# EasyEDA Pro project CM5_Mobo_final.epro, schematic Schematic1
Create Date: 2025-03-16; Page Name: P1; Project Name: CM5 mobo; Schematic Name: Schematic1; Update Date: 2025-06-30; Company: EasyEDA.com; Page Size: A4; Version: V1.0
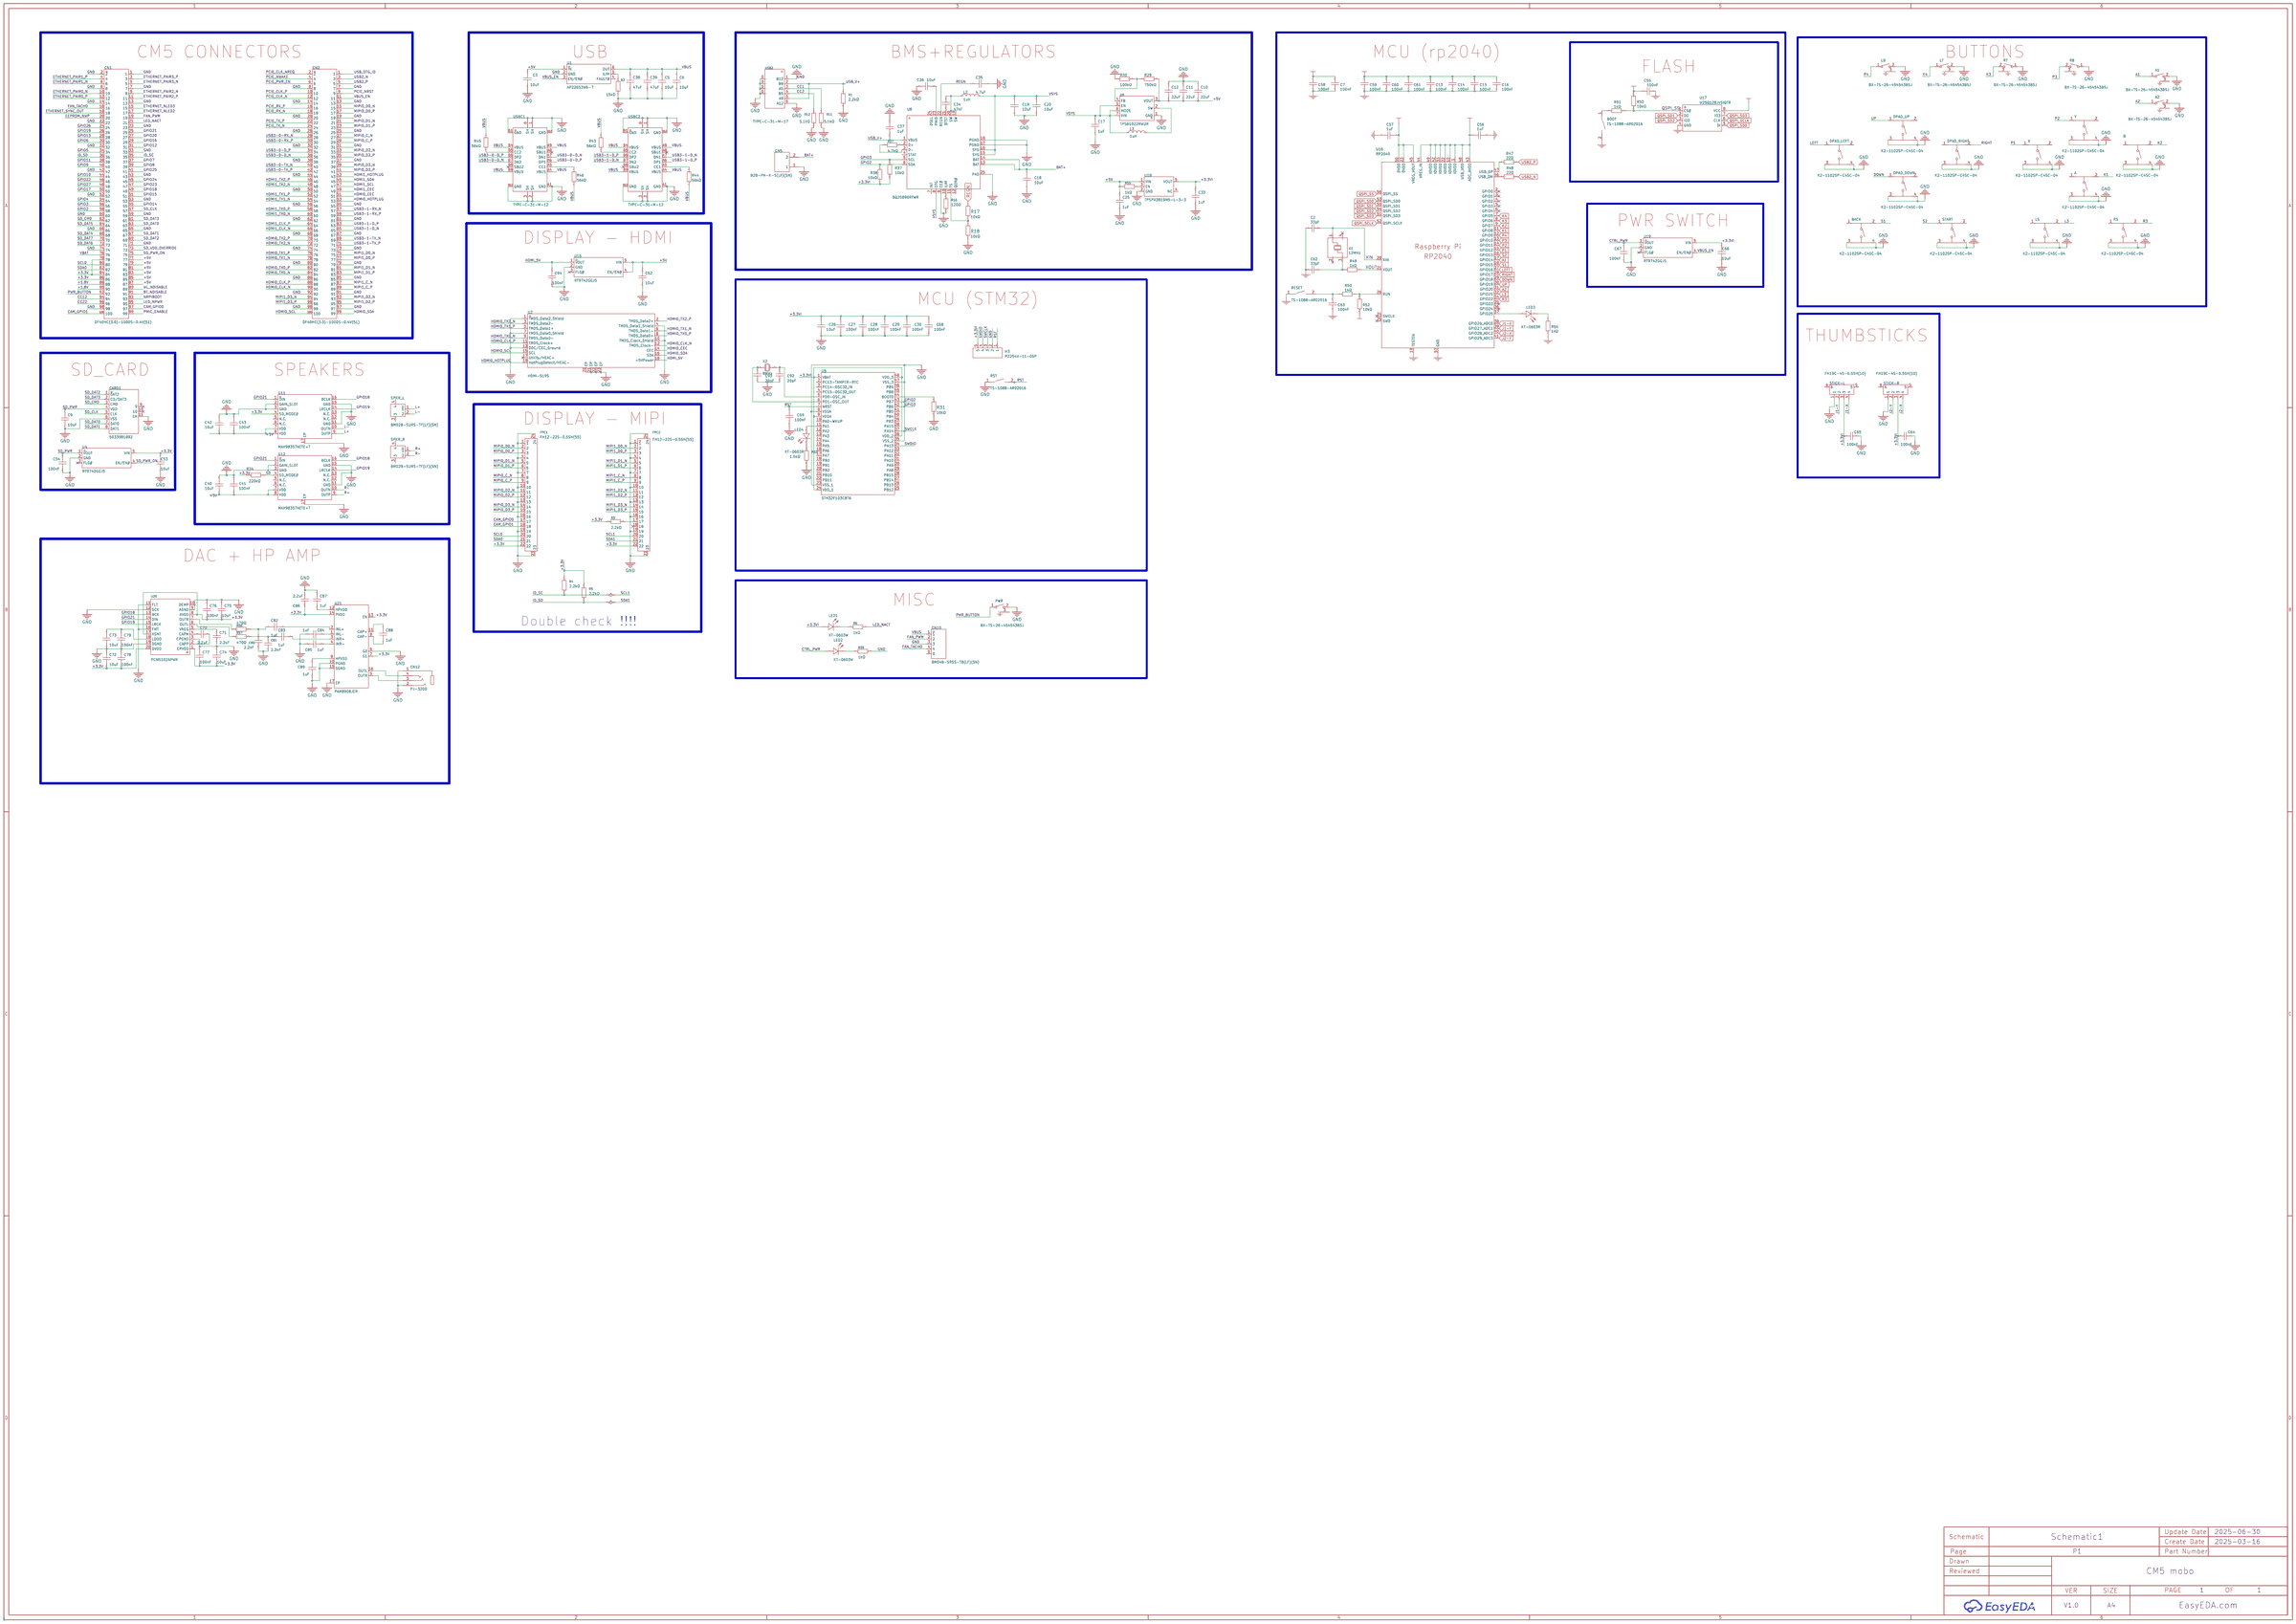
[diagram p0: schematic sheet]

## Parts
A  K2-1102SP-C4SC-04  [KEY-SMD_4P-L6.0-W6.0-P4.50-LS9.5-BL]
A1  BX-TS-26-454543BSJ  [SW-TH_3P-L4.5-W4.3-P3.00-LS1.9]
A2  BX-TS-26-454543BSJ  [SW-TH_3P-L4.5-W4.3-P3.00-LS1.9]
B  K2-1102SP-C4SC-04  [KEY-SMD_4P-L6.0-W6.0-P4.50-LS9.5-BL]
BACK  K2-1102SP-C4SC-04  [KEY-SMD_4P-L6.0-W6.0-P4.50-LS9.5-BL]
BOOT  TS-1088-AR02016  [SW-SMD_L3.9-W3.0-P4.45]
C2  33pF  [C0402]
C3  10uF  [C0805]
C5  10uF  [C0805]
C6  10uF  [C0805]
C7  100nF  [C0402]
C9  10uF  [C0805]
C10  22uF  [C0805]
C11  22uF  [C0805]
C12  22uF  [C0805]
C13  100nF  [C0402]
C14  100nF  [C0402]
C15  100nF  [C0402]
C16  100nF  [C0402]
C17  1uF  [C0603]
C18  10uF  [C0805]
C19  10uF  [C0805]
C20  10uF  [C0805]
C25  1uF  [C0603]
C26  10uF  [C0805]
C27  100nF  [C0402]
C28  100nF  [C0402]
C29  100nF  [C0402]
C30  100nF  [C0402]
C33  1uF  [C0603]
C34  47nF  [C0603]
C35  4.7uF  [C0603]
C36  10uF  [C0805]
C37  1uF  [C0603]
C38  47uF  [C1206]
C39  47uF  [C1206]
C40  10uF  [C0805]
C41  100nF  [C0402]
C42  10uF  [C0805]
C43  100nF  [C0402]
C52  10uF  [C0805]
C53  10uF  [C0805]
C54  100nF  [C0402]
C55  100nF  [C0402]
C56  1uF  [C0402]
C57  1uF  [C0402]
C58  100nF  [C0402]
C59  100nF  [C0402]
C60  100nF  [C0402]
C61  100nF  [C0402]
C62  33pF  [C0402]
C63  100nF  [C0402]
C64  100nF  [C0402]
C65  100nF  [C0402]
C66  10uF  [C0805]
C67  100nF  [C0402]
C68  100nF  [C0402]
C69  100nF  [C0402]
C70  2.2uF  [C0603]
C71  2.2uF  [C0603]
C72  10uF  [C0805]
C73  10uF  [C0805]
C74  10uF  [C0805]
C75  10uF  [C0805]
C76  100nF  [C0603]
C77  100nF  [C0603]
C78  100nF  [C0603]
C79  100nF  [C0603]
C80  2.2nF  [C0805]
C81  2.2nF  [C0805]
C82  1uF  [C0603]
C83  1uF  [C0603]
C84  1uF  [C0603]
C85  1uF  [C0603]
C86  2.2uF  [C0603]
C87  1uF  [C0603]
C88  1uF  [C0603]
C89  1uF  [C0603]
C92  20pF  [C0402]
C93  20pF  [C0402]
C94  100nF  [C0402]
CARD1  5033981892  [TF-SMD_503398-1892]
CN1  DF40HC(3.0)-100DS-0.4V(51)  [CONN-SMD_DF40HC-3.0-100DS-0.4V-51]
CN2  DF40HC(3.0)-100DS-0.4V(51)  [CONN-SMD_DF40HC-3.0-100DS-0.4V-51]
CN5  B2B-PH-K-S(LF)(SN)  [CONN-TH_B2B-PH-K-S]
CN10  BM04B-SRSS-TB(LF)(SN)  [CONN-SMD_BM04B-SRSS-TB]
CN12  PJ-320D  [AUDIO-SMD_PJ-320D]
DPAD_DOWN  K2-1102SP-C4SC-04  [KEY-SMD_4P-L6.0-W6.0-P4.50-LS9.5-BL]
DPAD_LEFT  K2-1102SP-C4SC-04  [KEY-SMD_4P-L6.0-W6.0-P4.50-LS9.5-BL]
DPAD_RIGHT  K2-1102SP-C4SC-04  [KEY-SMD_4P-L6.0-W6.0-P4.50-LS9.5-BL]
DPAD_UP  K2-1102SP-C4SC-04  [KEY-SMD_4P-L6.0-W6.0-P4.50-LS9.5-BL]
FPC1  FH12-22S-0.5SH(55)  [FPC-SMD_22P-P0.50_FH12-22S-0.5SH-55]
FPC2  FH12-22S-0.5SH(55)  [FPC-SMD_22P-P0.50_FH12-22S-0.5SH-55]
H3  PZ254V-11-05P  [HDR-TH_5P-P2.54-V-M]
L2  1uH  [IND-SMD_L4.4-W4.2]
L3  1uH  [IND-SMD_L4.4-W4.2]
LB  BX-TS-26-454543BSJ  [SW-TH_3P-L4.5-W4.3-P3.00-LS1.9]
LED1  KT-0603W  [LED0603-R-RD_WHITE]
LED2  KT-0603W  [LED0603-R-RD_WHITE]
LED3  KT-0603R  [LED0603-RD]
LED4  KT-0603R  [LED0603-RD]
LS  K2-1102SP-C4SC-04  [KEY-SMD_4P-L6.0-W6.0-P4.50-LS9.5-BL]
LT  BX-TS-26-454543BSJ  [SW-TH_3P-L4.5-W4.3-P3.00-LS1.9]
PWR  BX-TS-26-454543BSJ  [SW-TH_3P-L4.5-W4.3-P3.00-LS1.9]
R1  2.2kΩ  [R0402]
R2  15kΩ  [R0402]
R3  2.2kΩ  [R0402]
R4  2.2kΩ  [R0402]
R5  2.2kΩ  [R0402]
R6  1kΩ  [R0402]
R11  5.1kΩ  [R0402]
R12  5.1kΩ  [R0402]
R16  120Ω  [R0603]
R17  10kΩ  [R0603]
R18  10kΩ  [R0603]
R27  4.7kΩ  [R0402]
R29  750kΩ  [R0603]
R30  100kΩ  [R0603]
R31  10kΩ  [R0603]
R32  1.5kΩ  [R0402]
R34  220kΩ  [R0402]
R37  10kΩ  [R0402]
R38  10kΩ  [R0402]
R39  1kΩ  [R0402]
R43  56kΩ  [R0402]
R44  56kΩ  [R0402]
R45  56kΩ  [R0402]
R46  56kΩ  [R0402]
R47  22Ω  [R0402]
R48  22Ω  [R0402]
R49  1kΩ  [R0402]
R50  1kΩ  [R0402]
R51  1kΩ  [R0402]
R52  10kΩ  [R0402]
R53  10kΩ  [R0402]
R54  1kΩ  [R0402]
R55  1kΩ  [R0402]
R56  470Ω  [R0805]
R57  470Ω  [R0805]
RB  BX-TS-26-454543BSJ  [SW-TH_3P-L4.5-W4.3-P3.00-LS1.9]
RESET  TS-1088-AR02016  [SW-SMD_L3.9-W3.0-P4.45]
RS  K2-1102SP-C4SC-04  [KEY-SMD_4P-L6.0-W6.0-P4.50-LS9.5-BL]
RST  TS-1088-AR02016  [SW-SMD_L3.9-W3.0-P4.45]
RT  BX-TS-26-454543BSJ  [SW-TH_3P-L4.5-W4.3-P3.00-LS1.9]
SPKR_L  BM02B-SURS-TF(LF)(SN)  [CONN-SMD_2P-P0.80_BM02B-SURS-TF-LF-SN]
SPKR_R  BM02B-SURS-TF(LF)(SN)  [CONN-SMD_2P-P0.80_BM02B-SURS-TF-LF-SN]
START  K2-1102SP-C4SC-04  [KEY-SMD_4P-L6.0-W6.0-P4.50-LS9.5-BL]
STICK-L  FH19C-4S-0.5SH(10)  [FPC-SMD_FH19C-4S-0.5SH]
STICK-R  FH19C-4S-0.5SH(10)  [FPC-SMD_FH19C-4S-0.5SH]
U1  AP22653W6-7  [SOT-23-6_L2.9-W1.6-P0.95-LS2.8-BR]
U2  HDMI-519S  [HDMI-SMD_19P-P0.40-H-F_HDMI-519S]
U4  RT9742GGJ5  [TSOT-23-5_L2.9-W1.6-P0.95-LS2.8-BR]
U5  STM32F103C8T6  [LQFP-48_L7.0-W7.0-P0.50-LS9.0-BL]
U8  BQ25890RTWR  [WQFN-24_L4.0-W4.0-P0.50-BL-EP]
U9  TPS61022RWUR  [VQFN-7_L2.0-W2.0-P0.55-TL_RWU]
U11  MAX98357AETE+T  [TQFN-16_L3.0-W3.0-P0.50-BL-EP1.5]
U12  MAX98357AETE+T  [TQFN-16_L3.0-W3.0-P0.50-BL-EP1.5]
U15  RT9742GGJ5  [TSOT-23-5_L2.9-W1.6-P0.95-LS2.8-BR]
U16  RP2040  [LQFN-56_L7.0-W7.0-P0.4-EP]
U17  W25Q128JVSIQTR  [SOIC-8_L5.3-W5.3-P1.27-LS8.0-BL]
U18  TPSPX3819M5-L-3-3  [SOT-23-5_L3.0-W1.6-P0.95-LS2.8-BR]
U19  RT9742GGJ5  [TSOT-23-5_L2.9-W1.6-P0.95-LS2.8-BR]
U20  PCM5102APWR  [TSSOP-20_L6.5-W4.4-P0.65-LS6.4-BL]
U21  PAM8908JER  [QFN-16_L3.0-W3.0-P0.50-BL-EP1.7]
USB2  TYPE-C-31-M-17  [USB-C-SMD_10P-P1.00-L6.8-W8.9]
USBC1  TYPE-C-31-M-12  [USB-C_SMD-TYPE-C-31-M-12]
USBC2  TYPE-C-31-M-12  [USB-C_SMD-TYPE-C-31-M-12]
X  K2-1102SP-C4SC-04  [KEY-SMD_4P-L6.0-W6.0-P4.50-LS9.5-BL]
X1  12MHz  [OSC-SMD_4P-L3.2-W2.5-BL]
X2  8MHz  [CRYSTAL-SMD_L5.0-W3.2]
Y  K2-1102SP-C4SC-04  [KEY-SMD_4P-L6.0-W6.0-P4.50-LS9.5-BL]

## Library data of the parts
A B BACK DPAD_DOWN DPAD_LEFT DPAD_RIGHT DPAD_UP LS RS START X Y = K2-1102SP-C4SC-04: Circuit:SPST Actuator Style:Round Button Operating Force:250gf Mounting Style:Brick nogging Switch Length:6mm Switch Width:6mm Switch Height:5mm Contact Current:50mA Voltage Rating (DC):12V Insulation Resistance:100MΩ With Lamp:- Mechanical Life:10万次 Oper; LCSC Part Name: K2-1102SP-C4SC-04 贴片; Supplier Part: C127509; Manufacturer: 韩国韩荣; Supplier Footprint: SMD; JLCPCB Part Class: Extended Part; Datasheet: https://atta.szlcsc.com/upload/public/pdf/source/20180911/C188182_290538218D9CAA74C9E437566D743B7F.pdf; Supplier: LCSC; Circuit: SPST; Actuator Style: Round Button; Operating Force: 250gf; Mounting Style: Brick nogging; Switch Length: 6mm; Switch Width: 6mm; Switch Height: 5mm; Contact Current: 50mA; Voltage Rating (DC): 12V; Insulation Resistance: 100MΩ; Mechanical Life: 10万次; Operating Temperature: -25℃~+85℃
A1 A2 LB LT PWR RB RT = BX-TS-26-454543BSJ: Circuit:SPST Actuator Style:Round Button Operating Force:260gf Mounting Style:Direct Insert Switch Length:4.5mm Switch Width:4.5mm Switch Height:4.3mm Strike Gundam:Without bracket Contact Current:50mA Voltage Rating:12V Actuator/Cap Color:Black Pin Style; LCSC Part Name: 4.5x4.5x4.3边三脚; Supplier Part: C18078076; Manufacturer: Bossie(博锡); Supplier Footprint: 插件-3P,4.5x4.5mm; JLCPCB Part Class: Extended Part; Datasheet: https://atta.szlcsc.com/upload/public/pdf/source/20231017/C9E2CC52EFF4A1EA78B90A8989680BD6.pdf; Supplier: LCSC; Circuit: SPST; Actuator Style: Round Button; Operating Force: 260gf; Mounting Style: Direct Insert; Switch Length: 4.5mm; Switch Width: 4.5mm; Switch Height: 4.3mm; Strike Gundam: Without bracket; Contact Current: 50mA; Voltage Rating: 12V; Actuator/Cap Color: Black; Pin Style: PCPin; Mechanical Life: 100000 Times; Operating Temperature: -30℃~+80℃
BOOT RESET RST = TS-1088-AR02016: Circuit:SPST Actuator Style:Round Button Operating Force:160gf Mounting Style:Brick nogging Switch Length:4mm Switch Width:3mm Switch Height:2mm Strike Gundam:不带 Contact Current:50mA Voltage Rating (DC):12V Insulation Resistance:100MΩ Actuator/Cap Color:B; LCSC Part Name: 4*3*2mm 立贴 轻触开关; Supplier Part: C720477; Manufacturer: XUNPU(讯普); Supplier Footprint: SMD; JLCPCB Part Class: Basic Part; Datasheet: https://atta.szlcsc.com/upload/public/pdf/source/20200810/C720475_60D09DD6C54279ADDB2DC25100F1CC11.pdf; Supplier: LCSC; Circuit: SPST; Actuator Style: Round Button; Operating Force: 160gf; Mounting Style: Brick nogging; Switch Length: 4mm; Switch Width: 3mm; Switch Height: 2mm; Strike Gundam: 不带; Contact Current: 50mA; Voltage Rating (DC): 12V; Insulation Resistance: 100MΩ; Actuator/Cap Color: Black; Pin Style: SMDSplicing; Mechanical Life: 10万次; Operating Temperature: -30℃~+80℃
C2 C62 = 0402CG330J500NT: Supplier: LCSC; Manufacturer: FH(风华); Supplier Part: C1562; JLCPCB Part Class: Basic Part
C3 C5 C6 C9 C18-C20 C26 C36 C40 C42 C52 C53 C66 = CL21A106KAYNNNE_C15850: Capacitance: Tolerance:±10% Tolerance:±10% Voltage Rated: Temperature Coefficient:; LCSC Part Name: 10uF ±10% 25V; Supplier Part: C15850; Manufacturer: SAMSUNG(三星); Manufacturer Part: CL21A106KAYNNNE; Supplier Footprint: 0805; JLCPCB Part Class: Basic Part; Datasheet: https://atta.szlcsc.com/upload/public/pdf/source/20160218/1457707763339.pdf; Supplier: LCSC; Tolerance: ±10%
C7 C13-C16 C55 C58-C61 C63-C65 = CL05B104KO5NNNC: Supplier: LCSC; Manufacturer: SAMSUNG(三星); Supplier Part: C1525; JLCPCB Part Class: Basic Part
C10-C12 = CL21A226MAQNNNE: Capacitance: Tolerance:±20% Tolerance:±20% Voltage Rated: Temperature Coefficient:; LCSC Part Name: 22uF ±20% 25V; Supplier Part: C45783; Manufacturer: SAMSUNG(三星); Supplier Footprint: 0805; JLCPCB Part Class: Basic Part; Datasheet: https://atta.szlcsc.com/upload/public/pdf/source/20160218/1457707763339.pdf; Supplier: LCSC; Tolerance: ±20%
C17 C25 C33 C37 C82-C85 C87-C89 = CL10A105KB8NNNC: Capacitance: Tolerance:±10% Tolerance:±10% Voltage Rated: Temperature Coefficient:; LCSC Part Name: 1uF ±10% 50V; Supplier Part: C15849; Manufacturer: SAMSUNG(三星); Supplier Footprint: 0603; JLCPCB Part Class: Basic Part; Datasheet: https://atta.szlcsc.com/upload/public/pdf/source/20160218/1457707763339.pdf; Supplier: LCSC; Tolerance: ±10%
C27-C30 C41 C43 C54 C67-C69 = CL05B104KB54PNC: Capacitance: Tolerance:±10% Tolerance:±10% Voltage Rated: Temperature Coefficient:; LCSC Part Name: 100nF ±10% 50V; Supplier Part: C307331; Manufacturer: SAMSUNG(三星); Supplier Footprint: 0402; JLCPCB Part Class: Basic Part; Datasheet: https://atta.szlcsc.com/upload/public/pdf/source/20160218/1457707763339.pdf; Supplier: LCSC; Tolerance: ±10%
C34 = CL10B473KB8NNNC: Capacitance: Tolerance:±10% Tolerance:±10% Voltage Rated: Temperature Coefficient:; LCSC Part Name: 47nF ±10% 50V; Supplier Part: C1622; Manufacturer: SAMSUNG(三星); Supplier Footprint: 0603; JLCPCB Part Class: Basic Part; Datasheet: https://atta.szlcsc.com/upload/public/pdf/source/20160218/1457707763339.pdf; Supplier: LCSC; Tolerance: ±10%
C35 = CL10A475KO8NNNC: Capacitance: Tolerance:±10% Tolerance:±10% Voltage Rated: Temperature Coefficient:; LCSC Part Name: 4.7uF ±10% 16V; Supplier Part: C19666; Manufacturer: SAMSUNG(三星); Supplier Footprint: 0603; JLCPCB Part Class: Basic Part; Datasheet: https://atta.szlcsc.com/upload/public/pdf/source/20160218/1457707763339.pdf; Supplier: LCSC; Tolerance: ±10%
C38 C39 = CL31A476MPHNNNE: Capacitance: Tolerance:±20% Tolerance:±20% Voltage Rated: Temperature Coefficient:; LCSC Part Name: 47uF ±20% 10V; Supplier Part: C96123; Manufacturer: SAMSUNG(三星); Supplier Footprint: 1206; JLCPCB Part Class: Basic Part; Datasheet: https://atta.szlcsc.com/upload/public/pdf/source/20160218/1457707763339.pdf; Supplier: LCSC; Tolerance: ±20%
C56 C57 = CL05A105KA5NQNC: Supplier: LCSC; Manufacturer: SAMSUNG(三星); Supplier Part: C52923; JLCPCB Part Class: Basic Part
C70 C71 C86 = CL10A225KO8NNNC: Capacitance: Tolerance:±10% Tolerance:±10% Voltage Rated: Temperature Coefficient:; LCSC Part Name: 2.2uF ±10% 16V; Supplier Part: C23630; Manufacturer: SAMSUNG(三星); Supplier Footprint: 0603; JLCPCB Part Class: Basic Part; Datasheet: https://atta.szlcsc.com/upload/public/pdf/source/20160218/1457707763339.pdf; Supplier: LCSC; Tolerance: ±10%
C72-C75 = GRM21BR61H106KE43L: Capacitance: Tolerance:±10% Tolerance:±10% Voltage Rated: Temperature Coefficient:; LCSC Part Name: 10uF ±10% 50V; Supplier Part: C440198; Manufacturer: muRata(村田); Supplier Footprint: 0805; JLCPCB Part Class: Basic Part; Datasheet: https://atta.szlcsc.com/upload/public/pdf/source/20230811/95AAE0C9AF55EDC31B7A4D8B733F534E.pdf; Supplier: LCSC; Tolerance: ±10%
C76-C79 = CC0603KRX7R9BB104: Capacitance:100nF Tolerance:±10% Tolerance:±10% Voltage Rating:50V Temperature Coefficient:X7R; LCSC Part Name: 100nF ±10% 50V; Supplier Part: C14663; Manufacturer: YAGEO(国巨); Supplier Footprint: 0603; JLCPCB Part Class: Basic Part; Datasheet: https://atta.szlcsc.com/upload/public/pdf/source/20180910/C282072_33301C7F631E79921B82A8DAC6BCC5B3.pdf; Supplier: LCSC; Tolerance: ±10%; Voltage Rating: 50V; Temperature Coefficient: X7R
C80 C81 = CL21C222JBFNNNE: Capacitance: Tolerance:±5% Tolerance:±5% Voltage Rated: Temperature Coefficient:; LCSC Part Name: 2.2nF ±5% 50V; Supplier Part: C28260; Manufacturer: SAMSUNG(三星); Supplier Footprint: 0805; JLCPCB Part Class: Basic Part; Datasheet: https://atta.szlcsc.com/upload/public/pdf/source/20160218/1457707763339.pdf; Supplier: LCSC; Tolerance: ±5%
C92 C93 = 0402CG200J500NT: Capacitance: Tolerance:±5% Tolerance:±5% Voltage Rated: Temperature Coefficient:; LCSC Part Name: 20pF ±5% 50V; Supplier Part: C1554; Manufacturer: FH(风华); Supplier Footprint: 0402; JLCPCB Part Class: Basic Part; Datasheet: https://atta.szlcsc.com/upload/public/pdf/source/20200305/C486355_26A10D38EF8C2A5C37091D0039909270.pdf; Supplier: LCSC; Tolerance: ±5%
C94 = CL05B104KO5NNNC: Capacitance: Tolerance:±10% Tolerance:±10% Voltage Rated: Temperature Coefficient:; LCSC Part Name: 100nF ±10% 16V; Supplier Part: C1525; Manufacturer: SAMSUNG(三星); Supplier Footprint: 0402; JLCPCB Part Class: Basic Part; Datasheet: https://atta.szlcsc.com/upload/public/pdf/source/20160218/1457707763339.pdf; Supplier: LCSC; Tolerance: ±10%
CARD1 = 5033981892: Card Connection Mode:Self-bouncing Card Type:MicroSD card (TF card) Connector Type:Card Slot Additional Card Detection Pins:- Supplementary Features:- Maximum Body Height:1.28mm Operating Temperature Range:-25℃~+85℃ Operating Temperature Range:-25℃~+85℃; LCSC Part Name: 自弹式 MicroSD卡(TF卡) 卡座; Supplier Part: C428492; Manufacturer: MOLEX; Supplier Footprint: SMD; JLCPCB Part Class: Extended Part; Datasheet: https://www.molex.com/content/dam/molex/molex-dot-com/products/automated/en-us/salesdrawingpdf/503/503398/5033981892_sd.pdf?inline; Supplier: LCSC; Card Connection Mode: Self-bouncing; Card Type: MicroSD card (TF card); Connector Type: Card Slot; Maximum Body Height: 1.28mm; Operating Temperature Range: -25℃~+85℃
CN1 CN2 = DF40HC(3.0)-100DS-0.4V(51): Number of Pins:- Pitch:0.4mm Gender:Female Mounting Style:Brick nogging Number of Rows:2 Current Rating (Max):300mA Contact Plating:Gold Operating Temperature Range:-35℃~+85℃ Operating Temperature Range:-35℃~+85℃; LCSC Part Name: 间距:0.4mm 母 立贴; Supplier Part: C424649; Manufacturer: HRS(广濑); Supplier Footprint: SMD,P=0.4mm; JLCPCB Part Class: Extended Part; Datasheet: https://atta.szlcsc.com/upload/public/pdf/source/20190903/C424648_4BEB475664B3701E3114D0DD20EED667.pdf; Supplier: LCSC; Pitch: 0.4mm; Gender: Female; Mounting Style: Brick nogging; Number of Rows: 2; Current Rating (Max): 300mA; Contact Plating: Gold; Operating Temperature Range: -35℃~+85℃
CN5 = B2B-PH-K-S(LF)(SN): Pins Structure:1x2P Pitch:2mm Mounting Type:Direct Insert Reference Series:PH Number of Pins:2P Number of Rows:1 Number of PINs Per Row:2 Row Spacing:- Current Rating:2A Contact Material:Brass Contact Plating:Tin Operating Temperature:-25℃~+85℃ Operating; LCSC Part Name: 1x2P 间距:2mm 直插 系列:PH; Supplier Part: C131337; Manufacturer: JST; Supplier Footprint: 插件,P=2mm; JLCPCB Part Class: Extended Part; Datasheet: https://atta.szlcsc.com/upload/public/pdf/source/20171026/C131342_15089839687311058815.pdf; Supplier: LCSC; Pins Structure: 1x2P; Pitch: 2mm; Mounting Type: Direct Insert; Reference Series: PH; Number of Pins: 2P; Number of Rows: 1; Number of PINs Per Row: 2; Current Rating: 2A; Contact Material: Brass; Contact Plating: Tin; Operating Temperature: -25℃~+85℃; Voltage Rating: 100V; Plastic Material: PA66; Flame Retardant Rating: UL94V-0; Supplementary Features: K-leg punch; Color: White; Z-Height of the Board: 6mm; X-Length of Bottom Edge on Board (Spacing Line): 5.9mm; Y-Width of Bottom Edge on Board: 4.5mm
CN10 = BM04B-SRSS-TB(LF)(SN): Pins Structure:1x4P Pitch:1mm Mounting Style:Standing paste Reference Series:SH Number of Pins:4P Number of Rows:1 Number of PINs Per Row:4 Row Spacing:- Current Rating (Max):1A Contact Material:Copper alloy Contact Plating:Tin Operating Temperature Range; LCSC Part Name: 1x4P 间距:1mm 立贴 系列:SH; Supplier Part: C160390; Manufacturer: JST; Supplier Footprint: SMD,P=1mm; JLCPCB Part Class: Extended Part; Datasheet: https://atta.szlcsc.com/upload/public/pdf/source/20181008/C268118_5C0FE2784716D1E5DD0A36233D1E1F34.pdf; Supplier: LCSC; Pins Structure: 1x4P; Pitch: 1mm; Mounting Style: Standing paste; Reference Series: SH; Number of Pins: 4P; Number of Rows: 1; Number of PINs Per Row: 4; Current Rating (Max): 1A; Contact Material: Copper alloy; Contact Plating: Tin; Operating Temperature Range: -25℃~+85℃; Rated Voltage (Max): 50V; Plastic Material: PA; Flame Retardant Rating: UL94V-0; Supplementary Features: Auxiliary soldering legs; Colour: White; Z-Height of the Board: 4.25mm; X-Length of Bottom Edge on Board (Spacing Line): 6mm; Y-Width of Bottom Edge on Board: 3.6mm
CN12 = PJ-320D_C431535: Connector Type:3.5mm Headphone Jack Current Rating (Max):500mA Voltage Rating (Max):50V Contact Material:Copper Contact Plating:Silver Operating Temperature Range:-30℃~+70℃ Operating Temperature Range:-30℃~+70℃; LCSC Part Name: 3.5mm耳机座; Supplier Part: C431535; Manufacturer: SHOU HAN(首韩); Supplier Footprint: SMD; JLCPCB Part Class: Extended Part; Datasheet: https://atta.szlcsc.com/upload/public/pdf/source/20190925/C431535_8B274506621F6117FB020BF07A197848.pdf; Supplier: LCSC; Connector Type: 3.5mm Headphone Jack; Current Rating (Max): 500mA; Voltage Rating (Max): 50V; Contact Material: Copper; Contact Plating: Silver; Operating Temperature Range: -30℃~+70℃
FPC1 FPC2 = FH12-22S-0.5SH(55)_C597981: Locking Feature:Clamshell Contact Type:Bottom Contact Number of Contacts:22P Pitch:0.5mm Mounting Type:卧贴 FFC, FCB Thickness:0.3mm FFC, FCB Thickness:0.3mm Height Above Board:2mm Contact Material:Phosphor bronze Contact Plating:Gold Operating Temperature; LCSC Part Name: 间距:0.5mm P数:22P 翻盖式 下接; Supplier Part: C597981; Manufacturer: HRS(广濑); Supplier Footprint: SMD,P=0.5mm,卧贴; JLCPCB Part Class: Extended Part; Datasheet: https://atta.szlcsc.com/upload/public/pdf/source/20200615/C597979_B8D9DC319DDA9CB4DF2E85AE104C9A2E.pdf; Supplier: LCSC; Locking Feature: Clamshell; Contact Type: Bottom Contact; Number of Contacts: 22P; Pitch: 0.5mm; Mounting Type: 卧贴; FFC, FCB Thickness: 0.3mm; Height Above Board: 2mm; Contact Material: Phosphor bronze; Contact Plating: Gold; Operating Temperature Range: -40℃~+85℃
H3 = PZ254V-11-05P: Pin Structure:1x5P Pitch:2.54mm Row Spacing:- Circluar Pins/Square Pins:Policy Mounting Type:Straight Number of Rows:Single Row Number of Pins:5P Current Rating:- Voltage Rating (Max):- Length of Mating Pin:6mm Insulation Height:2.5mm Length of End Connec; LCSC Part Name: 1x5P 间距:2.54mm 方针 直插; Supplier Part: C492404; Manufacturer: XFCN(兴飞); Supplier Footprint: 插件,P=2.54mm; JLCPCB Part Class: Extended Part; Datasheet: https://atta.szlcsc.com/upload/public/pdf/source/20200309/C492404_E51533260F8710EFF5D4617281164C1D.pdf; Supplier: LCSC; Pin Structure: 1x5P; Pitch: 2.54mm; Circluar Pins/Square Pins: Policy; Mounting Type: Straight; Number of Rows: Single Row; Number of Pins: 5P; Length of Mating Pin: 6mm; Insulation Height: 2.5mm; Length of End Connection Pin: 3mm; Contact Material: Brass; Operating Temperature: -40℃~+105℃; Color: Black
L2 L3 = FXL0420-1R0-M: Inductance: Tolerance:±20% Tolerance:±20% Rated Current: Saturation Current (Isat):7A DC Resistance (DCR): Type:Integrated molded inductor; LCSC Part Name: 1uH ±20% 7A; Supplier Part: C167203; Manufacturer: cjiang(长江微电); Supplier Footprint: SMD,4.2x4.4mm; JLCPCB Part Class: Extended Part; Datasheet: https://atta.szlcsc.com/upload/public/pdf/source/20240426/3189EA8206330E2108542F9E34E540E7.pdf; Supplier: LCSC; Tolerance: ±20%; Saturation Current (Isat): 7A; Type: Integrated molded inductor
LED1 LED2 = KT-0603W: Emitted Color:White; LCSC Part Name: 0603 白灯 高亮; Supplier Part: C2290; Manufacturer: KENTO; Supplier Footprint: 0603; JLCPCB Part Class: Basic Part; Datasheet: https://atta.szlcsc.com/upload/public/pdf/source/20221101/4C23D5C85BA051E44A00B833D0A41468.pdf; Supplier: LCSC; Emitted Color: White
LED3 LED4 = KT-0603R: Emitted Color:Red Power Dissipation:- Forward Current:- Dominant Wavelength:- Dominant Wavelength:- Peak Wavelength:- Diode Configuration:- Lens Color:- Color Temperature:- Color Temperature:- Viewing Angle:- Mounting Sytle:- Operating Temperature:-40℃~+8; LCSC Part Name: 0603 红灯 高亮; Supplier Part: C2286; Manufacturer: KENTO; Supplier Footprint: 0603; JLCPCB Part Class: Basic Part; Datasheet: https://atta.szlcsc.com/upload/public/pdf/source/20160616/1466072038404.pdf; Supplier: LCSC; Emitted Color: Red; Operating Temperature: -40℃~+85℃
R1 R3-R5 = 0402WGF2201TCE: Type:Thick Film Resistors Resistance:2.2kΩ Tolerance:±1% Tolerance:±1% Power(Watts): Overload Voltage (Max): Temperature Coefficient:±100ppm/℃ Temperature Coefficient:±100ppm/℃ Operating Temperature Range:-55℃~+155℃ Operating Temperature Range:-55℃~+155℃; LCSC Part Name: 2.2kΩ ±1% 62.5mW 厚膜电阻; Supplier Part: C25879; Manufacturer: UNI-ROYAL(厚声); Supplier Footprint: 0402; JLCPCB Part Class: Basic Part; Datasheet: https://atta.szlcsc.com/upload/public/pdf/source/20200306/C422600_1E6D84923E4A46A82E41ADD87F860B5C.pdf; Supplier: LCSC; Type: Thick Film Resistors; Tolerance: ±1%; Temperature Coefficient: ±100ppm/℃; Operating Temperature Range: -55℃~+155℃
R2 = 0402WGF1502TCE: Type:Thick Film Resistors Resistance:15kΩ Tolerance:±1% Tolerance:±1% Power(Watts): Overload Voltage (Max): Temperature Coefficient:±100ppm/℃ Temperature Coefficient:±100ppm/℃ Operating Temperature Range:-55℃~+155℃ Operating Temperature Range:-55℃~+155℃; LCSC Part Name: 15kΩ ±1% 62.5mW 厚膜电阻; Supplier Part: C25756; Manufacturer: UNI-ROYAL(厚声); Supplier Footprint: 0402; JLCPCB Part Class: Basic Part; Datasheet: https://atta.szlcsc.com/upload/public/pdf/source/20200306/C422600_1E6D84923E4A46A82E41ADD87F860B5C.pdf; Supplier: LCSC; Type: Thick Film Resistors; Tolerance: ±1%; Temperature Coefficient: ±100ppm/℃; Operating Temperature Range: -55℃~+155℃
R6 R39 R55 = 0402WGF1001TCE: Type:Thick Film Resistors Resistance:1kΩ Tolerance:±1% Tolerance:±1% Power(Watts): Overload Voltage (Max): Temperature Coefficient:±100ppm/℃ Temperature Coefficient:±100ppm/℃ Operating Temperature Range:-55℃~+155℃ Operating Temperature Range:-55℃~+155℃; LCSC Part Name: 1kΩ ±1% 62.5mW 厚膜电阻; Supplier Part: C11702; Manufacturer: UNI-ROYAL(厚声); Supplier Footprint: 0402; JLCPCB Part Class: Basic Part; Datasheet: https://atta.szlcsc.com/upload/public/pdf/source/20200306/C422600_1E6D84923E4A46A82E41ADD87F860B5C.pdf; Supplier: LCSC; Type: Thick Film Resistors; Tolerance: ±1%; Temperature Coefficient: ±100ppm/℃; Operating Temperature Range: -55℃~+155℃
R11 R12 = 0402WGF5101TCE: Type:Thick Film Resistors Resistance:5.1kΩ Tolerance:±1% Tolerance:±1% Power(Watts): Overload Voltage (Max): Temperature Coefficient:±100ppm/℃ Temperature Coefficient:±100ppm/℃ Operating Temperature Range:-55℃~+155℃ Operating Temperature Range:-55℃~+155℃; LCSC Part Name: 5.1kΩ ±1% 62.5mW 厚膜电阻; Supplier Part: C25905; Manufacturer: UNI-ROYAL(厚声); Supplier Footprint: 0402; JLCPCB Part Class: Basic Part; Datasheet: https://atta.szlcsc.com/upload/public/pdf/source/20200306/C422600_1E6D84923E4A46A82E41ADD87F860B5C.pdf; Supplier: LCSC; Type: Thick Film Resistors; Tolerance: ±1%; Temperature Coefficient: ±100ppm/℃; Operating Temperature Range: -55℃~+155℃
R16 = 0603WAF1200T5E: Type:Thick Film Resistors Resistance: Tolerance:±1% Tolerance:±1% Power(Watts): Overload Voltage (Max): Temperature Coefficient:±100ppm/℃ Temperature Coefficient:±100ppm/℃ Operating Temperature Range:-55℃~+155℃ Operating Temperature Range:-55℃~+155℃; LCSC Part Name: 120Ω ±1% 100mW 厚膜电阻; Supplier Part: C22787; Manufacturer: UNI-ROYAL(厚声); Supplier Footprint: 0603; JLCPCB Part Class: Basic Part; Datasheet: https://atta.szlcsc.com/upload/public/pdf/source/20200306/C422600_1E6D84923E4A46A82E41ADD87F860B5C.pdf; Supplier: LCSC; Type: Thick Film Resistors; Tolerance: ±1%; Temperature Coefficient: ±100ppm/℃; Operating Temperature Range: -55℃~+155℃
R17 R18 R31 = 0603WAF1002T5E: Type:Thick Film Resistors Resistance:10kΩ Tolerance:±1% Tolerance:±1% Power(Watts): Overload Voltage (Max): Temperature Coefficient:±100ppm/℃ Temperature Coefficient:±100ppm/℃ Operating Temperature Range:-55℃~+155℃ Operating Temperature Range:-55℃~+155℃; LCSC Part Name: 厚膜电阻 10kΩ ±1% 100mW; Supplier Part: C25804; Manufacturer: UNI-ROYAL(厚声); Supplier Footprint: 0603; JLCPCB Part Class: Basic Part; Datasheet: https://atta.szlcsc.com/upload/public/pdf/source/20200306/C422600_1E6D84923E4A46A82E41ADD87F860B5C.pdf; Supplier: LCSC; Type: Thick Film Resistors; Tolerance: ±1%; Temperature Coefficient: ±100ppm/℃; Operating Temperature Range: -55℃~+155℃
R27 = 0402WGF4701TCE: Type:Thick Film Resistors Resistance:4.7kΩ Tolerance:±1% Tolerance:±1% Power(Watts): Overload Voltage (Max): Temperature Coefficient:±100ppm/℃ Temperature Coefficient:±100ppm/℃ Operating Temperature Range:-55℃~+155℃ Operating Temperature Range:-55℃~+155℃; LCSC Part Name: 4.7kΩ ±1% 62.5mW 厚膜电阻; Supplier Part: C25900; Manufacturer: UNI-ROYAL(厚声); Supplier Footprint: 0402; JLCPCB Part Class: Basic Part; Datasheet: https://atta.szlcsc.com/upload/public/pdf/source/20200306/C422600_1E6D84923E4A46A82E41ADD87F860B5C.pdf; Supplier: LCSC; Type: Thick Film Resistors; Tolerance: ±1%; Temperature Coefficient: ±100ppm/℃; Operating Temperature Range: -55℃~+155℃
R29 = 0603WAF7503T5E: Type:Thick Film Resistors Resistance:750kΩ Tolerance:±1% Tolerance:±1% Power(Watts): Overload Voltage (Max): Temperature Coefficient:±100ppm/℃ Temperature Coefficient:±100ppm/℃ Operating Temperature Range:-55℃~+155℃ Operating Temperature Range:-55℃~+155℃; LCSC Part Name: 750kΩ ±1% 100mW 厚膜电阻; Supplier Part: C23240; Manufacturer: UNI-ROYAL(厚声); Supplier Footprint: 0603; JLCPCB Part Class: Extended Part; Datasheet: https://atta.szlcsc.com/upload/public/pdf/source/20200306/C422600_1E6D84923E4A46A82E41ADD87F860B5C.pdf; Supplier: LCSC; Type: Thick Film Resistors; Tolerance: ±1%; Temperature Coefficient: ±100ppm/℃; Operating Temperature Range: -55℃~+155℃
R30 = 0603WAF1003T5E: Type:Thick Film Resistors Resistance:100kΩ Tolerance:±1% Tolerance:±1% Power(Watts): Overload Voltage (Max): Temperature Coefficient:±100ppm/℃ Temperature Coefficient:±100ppm/℃ Operating Temperature Range:-55℃~+155℃ Operating Temperature Range:-55℃~+155℃; LCSC Part Name: 100kΩ ±1% 100mW 厚膜电阻; Supplier Part: C25803; Manufacturer: UNI-ROYAL(厚声); Supplier Footprint: 0603; JLCPCB Part Class: Basic Part; Datasheet: https://atta.szlcsc.com/upload/public/pdf/source/20200306/C422600_1E6D84923E4A46A82E41ADD87F860B5C.pdf; Supplier: LCSC; Type: Thick Film Resistors; Tolerance: ±1%; Temperature Coefficient: ±100ppm/℃; Operating Temperature Range: -55℃~+155℃
R32 = 0402WGF1501TCE: Type:Thick Film Resistors Resistance:1.5kΩ Tolerance:±1% Tolerance:±1% Power(Watts): Overload Voltage (Max): Temperature Coefficient:±100ppm/℃ Temperature Coefficient:±100ppm/℃ Operating Temperature Range:-55℃~+155℃ Operating Temperature Range:-55℃~+155℃; LCSC Part Name: 1.5kΩ ±1% 62.5mW 厚膜电阻; Supplier Part: C25867; Manufacturer: UNI-ROYAL(厚声); Supplier Footprint: 0402; JLCPCB Part Class: Basic Part; Datasheet: https://atta.szlcsc.com/upload/public/pdf/source/20200306/C422600_1E6D84923E4A46A82E41ADD87F860B5C.pdf; Supplier: LCSC; Type: Thick Film Resistors; Tolerance: ±1%; Temperature Coefficient: ±100ppm/℃; Operating Temperature Range: -55℃~+155℃
R34 = 0402WGF2203TCE: Type:Thick Film Resistors Resistance:220kΩ Tolerance:±1% Tolerance:±1% Power(Watts): Overload Voltage (Max): Temperature Coefficient:±100ppm/℃ Temperature Coefficient:±100ppm/℃ Operating Temperature Range:-55℃~+155℃ Operating Temperature Range:-55℃~+155℃; LCSC Part Name: 220kΩ ±1% 62.5mW 厚膜电阻; Supplier Part: C25767; Manufacturer: UNI-ROYAL(厚声); Supplier Footprint: 0402; JLCPCB Part Class: Extended Part; Datasheet: https://atta.szlcsc.com/upload/public/pdf/source/20200306/C422600_1E6D84923E4A46A82E41ADD87F860B5C.pdf; Supplier: LCSC; Type: Thick Film Resistors; Tolerance: ±1%; Temperature Coefficient: ±100ppm/℃; Operating Temperature Range: -55℃~+155℃
R37 R38 = 0402WGF1002TCE: Type:Thick Film Resistors Resistance:10kΩ Tolerance:±1% Tolerance:±1% Power(Watts): Overload Voltage (Max): Temperature Coefficient:±100ppm/℃ Temperature Coefficient:±100ppm/℃ Operating Temperature Range:-55℃~+155℃ Operating Temperature Range:-55℃~+155℃; LCSC Part Name: 10kΩ ±1% 62.5mW 厚膜电阻; Supplier Part: C25744; Manufacturer: UNI-ROYAL(厚声); Supplier Footprint: 0402; JLCPCB Part Class: Basic Part; Datasheet: https://atta.szlcsc.com/upload/public/pdf/source/20200306/C422600_1E6D84923E4A46A82E41ADD87F860B5C.pdf; Supplier: LCSC; Type: Thick Film Resistors; Tolerance: ±1%; Temperature Coefficient: ±100ppm/℃; Operating Temperature Range: -55℃~+155℃
R43-R46 = 0402WGF5602TCE: Type:Thick Film Resistors Resistance:56kΩ Tolerance:±1% Tolerance:±1% Power(Watts): Overload Voltage (Max): Temperature Coefficient:±100ppm/℃ Temperature Coefficient:±100ppm/℃ Operating Temperature Range:-55℃~+155℃ Operating Temperature Range:-55℃~+155℃; LCSC Part Name: 56kΩ ±1% 62.5mW 厚膜电阻; Supplier Part: C25796; Manufacturer: UNI-ROYAL(厚声); Supplier Footprint: 0402; JLCPCB Part Class: Extended Part; Datasheet: https://atta.szlcsc.com/upload/public/pdf/source/20200306/C422600_1E6D84923E4A46A82E41ADD87F860B5C.pdf; Supplier: LCSC; Type: Thick Film Resistors; Tolerance: ±1%; Temperature Coefficient: ±100ppm/℃; Operating Temperature Range: -55℃~+155℃
R47 R48 = 0402WGF220JTCE: Supplier: LCSC; Manufacturer: UNI-ROYAL(厚声); Supplier Part: C25092; Resistance: 22; JLCPCB Part Class: Basic Part
R49-R51 R54 = 0402WGF1001TCE: Supplier: LCSC; Manufacturer: UNI-ROYAL(厚声); Supplier Part: C11702; Resistance: 1K; JLCPCB Part Class: Basic Part
R52 R53 = 0402WGF1002TCE: Supplier: LCSC; Manufacturer: UNI-ROYAL(厚声); Supplier Part: C25744; Resistance: 10K; JLCPCB Part Class: Basic Part
R56 R57 = 0805W8F4700T5E: Type:Thick Film Resistors Resistance: Tolerance:±1% Tolerance:±1% Power(Watts): Overload Voltage (Max): Temperature Coefficient:±100ppm/℃ Temperature Coefficient:±100ppm/℃ Operating Temperature Range:-55℃~+155℃ Operating Temperature Range:-55℃~+155℃; LCSC Part Name: 470Ω ±1% 125mW 厚膜电阻; Supplier Part: C17710; Manufacturer: UNI-ROYAL(厚声); Supplier Footprint: 0805; JLCPCB Part Class: Basic Part; Datasheet: https://atta.szlcsc.com/upload/public/pdf/source/20200306/C422600_1E6D84923E4A46A82E41ADD87F860B5C.pdf; Supplier: LCSC; Type: Thick Film Resistors; Tolerance: ±1%; Temperature Coefficient: ±100ppm/℃; Operating Temperature Range: -55℃~+155℃
SPKR_L SPKR_R = BM02B-SURS-TF(LF)(SN): Pins Structure:1x2P Pitch:0.8mm Mounting Style:Vertical welding Reference Series:SUR Number of Pins:2P Number of Rows:1 Number of PINs Per Row:2 Row Spacing:- Current Rating (Max):500mA Contact Material:Copper Alloy Contact Plating:Tin Operating Temperatu; LCSC Part Name: 1x2P 间距:0.8mm 立贴 系列:SUR; Supplier Part: C385130; Manufacturer: JST; Supplier Footprint: SMD,P=0.8mm; JLCPCB Part Class: Extended Part; Datasheet: https://atta.szlcsc.com/upload/public/pdf/source/20200311/C495545_E72935403D1EB49F793AD89C21E66448.pdf; Supplier: LCSC; Pins Structure: 1x2P; Pitch: 0.8mm; Mounting Style: Vertical welding; Reference Series: SUR; Number of Pins: 2P; Number of Rows: 1; Number of PINs Per Row: 2; Current Rating (Max): 500mA; Contact Material: Copper Alloy; Contact Plating: Tin; Operating Temperature Range: -25℃~+85℃; Rated Voltage (Max): 30V; Plastic Material: PA; Flame Retardant Rating: UL94V-0; Supplementary Features: 辅助焊脚; Colour: White; Z-Height of the Board: 2.7mm; X-Length of Bottom Edge on Board (Spacing Line): 3.8mm; Y-Width of Bottom Edge on Board: 2mm
STICK-L STICK-R = FH19C-4S-0.5SH(10): Locking Feature:Clamshell Contact Type:Bottom Contact Number of Contacts:4P Pitch:0.5mm Mounting Type:卧贴 FFC, FCB Thickness:0.2mm FFC, FCB Thickness:0.2mm Height Above Board:0.88mm Contact Material:Phosphor bronze Contact Plating:Gold Operating Temperatur; LCSC Part Name: 间距:0.5mm P数:4P 翻盖式 下接; Supplier Part: C424650; Manufacturer: HRS(广濑); Supplier Footprint: SMD,P=0.5mm,卧贴; JLCPCB Part Class: Extended Part; Datasheet: https://atta.szlcsc.com/upload/public/pdf/source/20190903/C424652_96088C35DDF9B9746B51C85A1732CDEC.pdf; Supplier: LCSC; Locking Feature: Clamshell; Contact Type: Bottom Contact; Number of Contacts: 4P; Pitch: 0.5mm; Mounting Type: 卧贴; FFC, FCB Thickness: 0.2mm; Height Above Board: 0.88mm; Contact Material: Phosphor bronze; Contact Plating: Gold; Operating Temperature Range: -55℃~+85℃
U1 = AP22653W6-7: Number of Outputs:1 Output Current:2.1A Input Voltage:3V~5.5V Input Voltage:3V~5.5V Resistor On-State:65mΩ Operating Temperature -:-40℃~+85℃ Operating Temperature -:-40℃~+85℃; Supplier Part: C2158037; Manufacturer: DIODES(美台); Supplier Footprint: SOT-26; JLCPCB Part Class: Extended Part; Datasheet: https://atta.szlcsc.com/upload/public/pdf/source/20210630/864BBA6F47FEA2EACA8A2C6E64AF9219.pdf; Supplier: LCSC; Number of Outputs: 1; Output Current: 2.1A; Input Voltage: 3V~5.5V; Resistor On-State: 65mΩ; Operating Temperature	-: -40℃~+85℃
U2 = HDMI-519S: Connector Type:HDMI-C Gender:Mother Number of Pins:19P Mounting Style:Horizontal attachment Current Rating (Max):- Rated Voltage (Max):- Operating Temperature Range:-10℃~+60℃ Operating Temperature Range:-10℃~+60℃; Supplier Part: C183605; Manufacturer: SOFNG(硕方); Supplier Footprint: SMD; JLCPCB Part Class: Extended Part; Datasheet: https://atta.szlcsc.com/upload/public/pdf/source/20180308/C183605_15204898542661414122.pdf; Supplier: LCSC; Connector Type: HDMI-C; Gender: Mother; Number of Pins: 19P; Mounting Style: Horizontal attachment; Operating Temperature Range: -10℃~+60℃
U4 U15 U19 = RT9742GGJ5: Number of Outputs:1 Output Current:1A Input Voltage:2.7V~6V Input Voltage:2.7V~6V Resistor On-State:70mΩ Operating Temperature -:-40℃~+85℃ Operating Temperature -:-40℃~+85℃; Supplier Part: C250547; Manufacturer: RICHTEK(立锜); Supplier Footprint: TSOT-23-5; JLCPCB Part Class: Extended Part; Datasheet: https://atta.szlcsc.com/upload/public/pdf/source/20180814/C250547_E58B04562B5F7112C93017421383FC36.pdf; Supplier: LCSC; Number of Outputs: 1; Output Current: 1A; Input Voltage: 2.7V~6V; Resistor On-State: 70mΩ; Operating Temperature	-: -40℃~+85℃
U5 = STM32F103C8T6: CPU Core:ARM-M3 CPU Maximum Speed:72MHz Program Storage Size:64KB Program Memory Type:FLASH Number of I/O:37 ADC (Bit):12bit Low Voltage Detection Threshold:2V~3.6V Low Voltage Detection Threshold:2V~3.6V Application Area:-; LCSC Part Name: 主流增强型ARM Cortex-M3 MCU，具有64 KB Flash、72 MHz CPU、电机控制、USB和CAN; Supplier Part: C8734; Manufacturer: ST(意法半导体); Supplier Footprint: LQFP-48(7x7); JLCPCB Part Class: Extended Part; Datasheet: https://atta.szlcsc.com/upload/public/pdf/source/20220812/8363ACEC51AD55ECEB84799464F7CB85.pdf; Supplier: LCSC; CPU Core: ARM-M3; CPU Maximum Speed: 72MHz; Program Storage Size: 64KB; Program Memory Type: FLASH; Number of I/O: 37; ADC (Bit): 12bit; Low Voltage Detection Threshold: 2V~3.6V
U8 = BQ25890RTWR: Supplier Part: C130451; Manufacturer: TI(德州仪器); Supplier Footprint: WQFN-24-EP(4x4); JLCPCB Part Class: Extended Part; Datasheet: https://www.ti.com/cn/lit/gpn/bq25890; Supplier: LCSC
U9 = TPS61022RWUR: Function:boost converterType Output Type:Adjustable Input Voltage:500mV~5.5V Input Voltage:500mV~5.5V Output Voltage:2.2V~5.5V Output Voltage:2.2V~5.5V Output Current (Max):- Switching Frequency:1MHz；600kHz Operating Temperature:-40℃~+125℃@(TJ) Operating; Supplier Part: C915088; Manufacturer: TI(德州仪器); Supplier Footprint: VQFN-7(2x2); JLCPCB Part Class: Extended Part; Datasheet: https://www.ti.com/cn/lit/gpn/tps61022; Supplier: LCSC; Function: boost converterType; Output Type: Adjustable; Input Voltage: 500mV~5.5V; Output Voltage: 2.2V~5.5V; Switching Frequency: 1MHz；600kHz; Operating Temperature: -40℃~+125℃@(TJ); Synchronous Rectification: Yes; Number of Outputs: 1; Topology: Boost; Switch tube (built-in/external): 内置
U11 U12 = MAX98357AETE+T: Type of Power Amplifier: Speaker Channels:Monaural Output Power: Supply Voltage:2.5V~5.5V Supply Voltage:2.5V~5.5V Operating Temperature:-40℃~+85℃ Operating Temperature:-40℃~+85℃; LCSC Part Name: 微型、低成本、PCM 类 D 级放大器具有 AB 级性能; Supplier Part: C910544; Manufacturer: ADI(亚德诺)/MAXIM(美信); Supplier Footprint: TQFN-16-EP(3x3); JLCPCB Part Class: Extended Part; Datasheet: https://atta.szlcsc.com/upload/public/pdf/source/20210106/C910544_CB6DE4B2CEE254A72E6BDB40E718D281.pdf; Supplier: LCSC; Speaker Channels: Monaural; Supply Voltage: 2.5V~5.5V; Operating Temperature: -40℃~+85℃
U16 = RP2040: Supplier: LCSC; Supplier Part: C2040; Manufacturer: Raspberry Pi(树莓派); JLCPCB Part Class: Extended Part
U17 = W25Q128JVSIQ: Supplier: LCSC; Manufacturer: WINBOND(华邦); Supplier Part: C97521; JLCPCB Part Class: Basic Part
U18 = TPSPX3819M5-L-3-3: Output Type:Fixed Voltage - Supply:20V Output Voltage:3.3V Output Voltage:3.3V Output Current:500mA Power Supply Rejection Ratio (PSRR):- Operating Temperature:-40℃~+125℃@(Tj) Operating Temperature:-40℃~+125℃@(Tj) Output Configuration:Positive electrode N; Supplier Part: C5370980; Manufacturer: TECH PUBLIC(台舟); Supplier Footprint: SOT-23-5; JLCPCB Part Class: Extended Part; Datasheet: https://atta.szlcsc.com/upload/public/pdf/source/20231102/1CEED3DA25748E8590103A514E6172D9.pdf; Supplier: LCSC; Output Type: Fixed; Voltage - Supply: 20V; Output Voltage: 3.3V; Output Current: 500mA; Operating Temperature: -40℃~+125℃@(Tj); Output Configuration: Positive electrode; Number of Outputs: 1
U20 = PCM5102APWR: Interface Type:PCM Supply Voltage:1.65V~3.46V Supply Voltage:1.65V~3.46V Number of Channels:2 Resolution:24；16；32 Operating Temperature:-25℃~+85℃ Operating Temperature:-25℃~+85℃; Supplier Part: C107671; Manufacturer: TI(德州仪器); Supplier Footprint: TSSOP-20; JLCPCB Part Class: Extended Part; Datasheet: https://www.ti.com/cn/lit/gpn/pcm5102a; Supplier: LCSC; Interface Type: PCM; Supply Voltage: 1.65V~3.46V; Number of Channels: 2; Resolution: 24；16；32; Operating Temperature: -25℃~+85℃
U21 = PAM8908JER: Class:AB Class Amplifier Speaker Channels:Dual Channel Output Power:35mWx2@16Ω Voltage - Supply:2.5V~5.5V Voltage - Supply:2.5V~5.5V; LCSC Part Name: 35mW立体声AB类音频功率放大器; Supplier Part: C33233; Manufacturer: DIODES(美台); Supplier Footprint: QFN-16-EP(3x3); JLCPCB Part Class: Extended Part; Datasheet: https://atta.szlcsc.com/upload/public/pdf/source/20241225/198AA8C4DF618023934B9402F7273380.pdf; Supplier: LCSC; Class: AB Class Amplifier; Speaker Channels: Dual Channel; Output Power: 35mWx2@16Ω; Voltage - Supply: 2.5V~5.5V
USB2 = TYPE-C-31-M-17: Connector Type:Type-C Standard:- Gender:Female Number of Ports:1 Number of Contacts:6P; LCSC Part Name: Type-C 母; Supplier Part: C283540; Manufacturer: 韩国韩荣; Supplier Footprint: SMD; JLCPCB Part Class: Extended Part; Datasheet: https://atta.szlcsc.com/upload/public/pdf/source/20210810/2CA2393895E95C87AA0C31BED5399791.pdf; Supplier: LCSC; Connector Type: Type-C; Gender: Female; Number of Ports: 1; Number of Contacts: 6P
USBC1 USBC2 = TYPE-C-31-M-12: Connector Type:Type-C Standard:- Gender:Female Mounting Style:- Number of Contacts:16P Number of Ports:1 Current Rating - Power (Max):5A Operating Temperature Range:- Operating Temperature Range:-; LCSC Part Name: Type-C 母; Supplier Part: C165948; Manufacturer: 韩国韩荣; Supplier Footprint: SMD; JLCPCB Part Class: Extended Part; Datasheet: https://atta.szlcsc.com/upload/public/pdf/source/20220525/466408E853115E789EDB0DDC29077C05.pdf; Supplier: LCSC; Connector Type: Type-C; Gender: Female; Number of Contacts: 16P; Number of Ports: 1; Current Rating - Power (Max): 5A
X1 = X322512MSB4SI: Supplier: LCSC; Manufacturer: YXC; Supplier Part: C9002; JLCPCB Part Class: Basic Part
X2 = X50328MSB2GI: Type:Surface Mount Crystal Frequency:8MHz Normal temperature Frequency Tolerance:±10ppm Normal temperature Frequency Tolerance:±10ppm Load Capacitance: Frequency Stability:±20ppm Frequency Stability:±20ppm Operating Temperature:-40℃~+85℃ Operating Tempera; LCSC Part Name: 8MHz ±10ppm 20pF; Supplier Part: C115962; Manufacturer: YXC(扬兴晶振); Supplier Footprint: SMD5032; JLCPCB Part Class: Basic Part; Datasheet: https://atta.szlcsc.com/upload/public/pdf/source/20240329/44922B0AF7B60E58E9B66993B6077277.pdf; Supplier: LCSC; Type: Surface Mount Crystal; Normal temperature Frequency Tolerance: ±10ppm; Frequency Stability: ±20ppm; Operating Temperature: -40℃~+85℃

## Nets
+1.8V: CN1.88 CN1.90
+1V1: C7.2 C57.1 C58.2 U16.23(DVDD) U16.45(VREG_VOUT) U16.50(DVDD)
+3.3V: C53.2 C72.2 C74.2 C75.2 C76.2 C77.2 C78.2 C86.1 CN1.78 CN1.84 CN1.86 FPC1.22 FPC2.22 R3.1 R4.1 R5.1 R34.2 U4.5(VIN) U11.4(SD_MODE#) U20.1(CPVDD) U20.8(AVDD) U20.17(XSMT) U20.20(DVDD) U21.7(G1) U21.13(EN) U21.14(PVDD)
+3.3VI: C26.1 C27.1 C28.1 C29.1 C30.1 C33.1 C64.1 C65.1 C66.2 C68.1 H3.5 LED1.1(A) R37.2 R38.2 STICK-L.3 STICK-R.3 U5.1(VBAT) U5.9(VDDA) U5.24(VDD_1) U5.36(VDD_2) U5.48(VDD_3) U18.5(VOUT) U19.5(VIN)
+5V: C3.1 C10.1 C11.1 C12.1 C25.1 C40.1 C41.1 C42.1 C43.1 C52.1 CN1.77 CN1.79 CN1.81 CN1.83 CN1.85 CN1.87 R29.2 R55.1 U1.1(IN) U9.3(VOUT) U11.7(VDD) U11.8(VDD) U12.7(VDD) U12.8(VDD) U15.4(EN/EN#) U15.5(VIN) U18.1(VIN)
GND: A.3 A.4 A1.2 A2.2 B.3 B.4 BACK.3 BACK.4 BOOT.2 C2.1 C3.2 C5.2 C6.2 C7.1 C9.2 C10.2 C11.2 C12.2 C13.1 C14.1 C15.1 C16.1 C17.2 C18.2 C19.2 C20.2 C25.2 C26.2 C27.2 C28.2 C29.2 C30.2 C33.2 C35.2 C36.1 C37.1 C38.2 C39.2 C40.2 C41.2 C42.2 C43.2 C52.2 C53.1 C54.1 C55.1 C56.2 C57.2 C58.1 C59.1 C60.1 C61.1 C62.1 C63.1 C64.2 C65.2 C66.1 C67.1 C68.2 C69.2 C71.1 C72.1 C73.2 C74.1 C75.1 C76.1 C77.1 C78.1 C79.2 C80.2 C81.2 C84.2 C85.2 C86.2 C87.2 C89.1 C92.2 C93.2 C94.2 CARD1.6(VSS) CARD1.11(EH) CN1.1 CN1.2 CN1.7 CN1.8 CN1.13 CN1.14 CN1.22 CN1.23 CN1.32 CN1.33 CN1.42 CN1.43 CN1.52 CN1.53 CN1.59 CN1.60 CN1.65 CN1.66 CN1.71 CN1.74 CN1.98 CN2.7 CN2.8 CN2.13 CN2.14 CN2.19 CN2.20 CN2.25 CN2.26 CN2.31 CN2.32 CN2.37 CN2.38 CN2.44 CN2.50 CN2.55 CN2.56 CN2.61 CN2.62 CN2.67 CN2.68 CN2.73 CN2.74 CN2.79 CN2.80 CN2.85 CN2.86 CN2.91 CN2.92 CN2.97 CN2.98 CN5.1 CN10.3 CN12.1 CN12.2 DPAD_DOWN.3 DPAD_DOWN.4 DPAD_LEFT.3 DPAD_LEFT.4 DPAD_RIGHT.3 DPAD_RIGHT.4 DPAD_UP.3 DPAD_UP.4 FPC1.1 FPC1.4 FPC1.7 FPC1.10 FPC1.13 FPC1.16 FPC1.19 FPC1.23 FPC1.24 FPC2.1 FPC2.4 FPC2.7 FPC2.10 FPC2.13 FPC2.16 FPC2.19 FPC2.23 FPC2.24 H3.2 LB.2 LS.3 LS.4 LT.2 PWR.2 R1.2 R2.2 R11.2 R12.2 R16.2 R18.2 R30.1 R31.2 R32.2 R39.2 R54.1 RB.1 RESET.1 RS.3 RS.4 RST.1 RT.1 START.3 START.4 STICK-L.1 STICK-R.1 U1.2(GND) U2.1(TMDS_Data2_Shield) U2.4(TMDS_Data1_Shield) U2.7(TMDS_Data0_Shield) U2.10(TMDS_Clock_Shield) U2.13(DDC/CEC_Ground) U2.20(EP) U2.21(EP) U2.22(EP) U2.23(EP) U4.2(GND) U5.8(VSSA) U5.23(VSS_1) U5.35(VSS_2) U5.47(VSS_3) U8.9(CE#) U8.17(PGND) U8.18(PGND) U8.25(PAD) U9.1(GND) U11.2(GAIN_SLOT) U11.3(GND) U11.11(GND) U11.15(GND) U11.17(EP) U12.2(GAIN_SLOT) U12.3(GND) U12.11(GND) U12.15(GND) U12.17(EP) U15.2(GND) U16.19(TESTEN) U16.57(GND) U17.4(GND) U18.2(GND) U19.2(GND) U20.3(CPGND) U20.9(AGND) U20.10(DEMP) U20.11(FLT) U20.12(SCK) U20.16(FMT) U20.19(DGND) U21.6(G0) U21.10(PGND) U21.15(SGND) U21.17(EP) USB2.0 USB2.1(B12) USB2.6(A12) USBC1.0(SH) USBC1.1(SH) USBC1.2(SH) USBC1.3(SH) USBC1.A1(GND) USBC1.A12(GND) USBC1.B1(GND) USBC1.B12(GND) USBC2.0(SH) USBC2.1(SH) USBC2.2(SH) USBC2.3(SH) USBC2.A1(GND) USBC2.A12(GND) USBC2.B1(GND) USBC2.B12(GND) X.3 X.4 Y.3 Y.4
VBAT: CN1.76
VBUS: C5.1 C6.1 C38.1 C39.1 CN10.1 R43.2 R44.2 R45.2 R46.2 U1.6(OUT) USBC1.A4(VBUS) USBC1.A9(VBUS) USBC1.B4(VBUS) USBC1.B9(VBUS) USBC2.A4(VBUS) USBC2.A9(VBUS) USBC2.B4(VBUS) USBC2.B9(VBUS)
VBUS_EN: CN2.11 U1.3(EN/EN#) U19.4(EN/EN#)
A1: A1.1 U16.17(GPIO14)
A2: A2.1 U16.31(GPIO20)
BAT+: C18.1 CN5.2 U8.13(BAT) U8.14(BAT)
BT_NDISABLE: CN1.91
CAM_GPIO0: CN1.97 FPC1.17
CAM_GPIO1: CN1.100 FPC1.18
CC1: R11.1 USB2.3(A5)
CC2: R12.1 USB2.4(B5)
CC12: CN1.94
CC22: CN1.96
CTRL_PWR: C13.2 C14.2 C15.2 C16.2 C55.2 C56.1 C59.2 C60.2 C61.2 C67.2 LED2.1(A) R52.1 R53.2 U16.1(IOVDD) U16.10(IOVDD) U16.22(IOVDD) U16.33(IOVDD) U16.42(IOVDD) U16.43(ADC_AVDD) U16.44(VREG_IN) U16.48(USB_VDD) U16.49(IOVDD) U17.8(VCC) U19.1(VOUT)
DOWN: DPAD_DOWN.1 U16.29(GPIO18)
EEPROM_NWP: CN1.20
ETHERNET_NLED2: CN1.17
ETHERNET_NLED3: CN1.15
ETHERNET_PAIR0_N: CN1.10
ETHERNET_PAIR0_P: CN1.12
ETHERNET_PAIR1_N: CN1.6
ETHERNET_PAIR1_P: CN1.4
ETHERNET_PAIR2_N: CN1.9
ETHERNET_PAIR2_P: CN1.11
ETHERNET_PAIR3_N: CN1.5
ETHERNET_PAIR3_P: CN1.3
ETHERNET_SYNC_OUT: CN1.18
FAN_PWM: CN1.19 CN10.2
FAN_TACHO: CN1.16 CN10.4
GPIO2: CN1.58 R38.1 U5.43(PB7) U8.6(SDA)
GPIO3: CN1.56 R37.1 U5.42(PB6) U8.5(SCL)
GPIO4: CN1.54
GPIO5: CN1.34
GPIO6: CN1.30
GPIO7: CN1.37
GPIO8: CN1.39
GPIO9: CN1.40
GPIO10: CN1.44
GPIO11: CN1.38
GPIO12: CN1.31
GPIO13: CN1.28
GPIO14: CN1.55
GPIO15: CN1.51
GPIO16: CN1.29
GPIO17: CN1.50
GPIO18: CN1.49 U11.16(BCLK) U12.16(BCLK) U20.13(BCK)
GPIO19: CN1.26 U11.14(LRCLK) U12.14(LRCLK) U20.15(LRCK)
GPIO20: CN1.27
GPIO21: CN1.25 U11.1(DIN) U12.1(DIN) U20.14(DIN)
GPIO22: CN1.46
GPIO23: CN1.47
GPIO24: CN1.45
GPIO25: CN1.41
GPIO26: CN1.24
GPIO27: CN1.48
HDMI0_CEC: CN2.51 U2.14(CEC)
HDMI0_CLK_N: CN2.90 U2.12(TMDS_Clock-)
HDMI0_CLK_P: CN2.88 U2.11(TMDS_Clock+)
HDMI0_HOTPLUG: CN2.53 U2.19(HotPlugDetect/HEAC-)
HDMI0_SCL: CN2.100 U2.15(SCL)
HDMI0_SDA: CN2.99 U2.16(SDA)
HDMI0_TX0_N: CN2.84 U2.9(TMDS_Data0-)
HDMI0_TX0_P: CN2.82 U2.8(TMDS_Data0+)
HDMI0_TX1_N: CN2.78 U2.6(TMDS_Data1-)
HDMI0_TX1_P: CN2.76 U2.5(TMDS_Data1+)
HDMI0_TX2_N: CN2.72 U2.3(TMDS_Data2-)
HDMI0_TX2_P: CN2.70 U2.2(TMDS_Data2+)
HDMI1_CEC: CN2.49
HDMI1_CLK_N: CN2.66
HDMI1_CLK_P: CN2.64
HDMI1_HOTPLUG: CN2.43
HDMI1_SCL: CN2.47
HDMI1_SDA: CN2.45
HDMI1_TX0_N: CN2.60
HDMI1_TX0_P: CN2.58
HDMI1_TX1_N: CN2.54
HDMI1_TX1_P: CN2.52
HDMI1_TX2_N: CN2.48
HDMI1_TX2_P: CN2.46
HDMI_5V: C94.1 U2.18(+5VPower) U15.1(VOUT)
ID_SC: CN1.35 FPC2.20 R4.2
ID_SD: CN1.36 FPC2.21 R5.2
J1-X: STICK-L.4 U16.38(GPIO26_ADC0)
J1-Y: STICK-L.2 U16.39(GPIO27_ADC1)
J2-X: STICK-R.4 U16.40(GPIO28_ADC2)
J2-Y: STICK-R.2 U16.41(GPIO29_ADC3)
K1: A.2 U16.11(GPIO8)
K2: B.2 U16.9(GPIO7)
K3: RT.2 U16.8(GPIO6)
K4: LT.1 U16.7(GPIO5)
L3: LS.2 U16.32(GPIO21)
L+: SPKR_L.1 U11.9(OUTP)
L-: SPKR_L.2 U11.10(OUTN)
LED_NACT: CN1.21 R6.2
LED_NPWR: CN1.95
LEFT: DPAD_LEFT.1 U16.27(GPIO16)
MIPI0_C_N: CN2.27 FPC1.8
MIPI0_C_P: CN2.29 FPC1.9
MIPI0_D0_N: CN2.15 FPC1.2
MIPI0_D0_P: CN2.17 FPC1.3
MIPI0_D1_N: CN2.21 FPC1.5
MIPI0_D1_P: CN2.23 FPC1.6
MIPI0_D2_N: CN2.33 FPC1.11
MIPI0_D2_P: CN2.35 FPC1.12
MIPI0_D3_N: CN2.39 FPC1.14
MIPI0_D3_P: CN2.41 FPC1.15
MIPI1_C_N: CN2.87 FPC2.8
MIPI1_C_P: CN2.89 FPC2.9
MIPI1_D0_N: CN2.75 FPC2.2
MIPI1_D0_P: CN2.77 FPC2.3
MIPI1_D1_N: CN2.81 FPC2.5
MIPI1_D1_P: CN2.83 FPC2.6
MIPI1_D2_N: CN2.93 FPC2.11
MIPI1_D2_P: CN2.95 FPC2.12
MIPI1_D3_N: CN2.94 FPC2.14
MIPI1_D3_P: CN2.96 FPC2.15
NRPIBOOT: CN1.93
P1: U16.15(GPIO12) X.1
P2: U16.14(GPIO11) Y.1
P3: RB.2 U16.13(GPIO10)
P4: LB.1 U16.12(GPIO9)
PCIE_CLK_N: CN2.12
PCIE_CLK_NREQ: CN2.2
PCIE_CLK_P: CN2.10
PCIE_NRST: CN2.9
PCIE_NWAKE: CN2.4
PCIE_PWR_EN: CN2.6
PCIE_RX_N: CN2.18
PCIE_RX_P: CN2.16
PCIE_TX_N: CN2.24
PCIE_TX_P: CN2.22
PMIC_ENABLE: CN1.99
PWR_BUTTON: CN1.92 PWR.1
QSPI_SCLK: U16.52(QSPI_SCLK) U17.6(CLK)
QSPI_SD0: U16.53(QSPI_SD0) U17.5(DI)
QSPI_SD1: U16.55(QSPI_SD1) U17.2(DO)
QSPI_SD2: U16.54(QSPI_SD2) U17.3(IO2)
QSPI_SD3: U16.51(QSPI_SD3) U17.7(IO3)
QSPI_SS: R51.2 R53.1 U16.56(QSPI_SS) U17.1(CS#)
R3: RS.2 U16.34(GPIO22)
R+: SPKR_R.1 U12.9(OUTP)
R-: SPKR_R.2 U12.10(OUTN)
REGN: C35.1 R17.1 U8.22(REGN)
RIGHT: DPAD_RIGHT.2 U16.28(GPIO17)
RST: C69.1 H3.1 RST.2 U5.7(NRST)
S1: BACK.2 U16.18(GPIO15)
S2: START.1 U16.16(GPIO13)
SCL0: CN1.80 FPC1.20
SD: R34.1 U12.4(SD_MODE#)
SD_CLK: CARD1.5(CLK) CN1.57
SD_CMD: CARD1.3(CMD) CN1.62
SD_DAT0: CARD1.7(DAT0) CN1.63
SD_DAT1: CARD1.8(DAT1) CN1.67
SD_DAT2: CARD1.1(DAT2) CN1.69
SD_DAT3: CARD1.2(CD/DAT3) CN1.61
SD_DAT4: CN1.68
SD_DAT5: CN1.64
SD_DAT6: CN1.72
SD_DAT7: CN1.70
SD_PWR: C9.1 C54.2 CARD1.4(VDD) U4.1(VOUT)
SD_PWR_ON: CN1.75 U4.4(EN/EN#)
SD_VDD_OVERRIDE: CN1.73
SDA0: CN1.82 FPC1.21
SWCLK: H3.3 U5.37(PA14)
SWDIO: H3.4 U5.34(PA13)
UP: DPAD_UP.1 U16.30(GPIO19)
USB2_N: CN2.3 R48.2
USB2_P: CN2.5 R47.1
USB3-0-D_N: CN2.36 USBC1.A7(DN1) USBC1.B7(DN2)
USB3-0-D_P: CN2.34 USBC1.A6(DP1) USBC1.B6(DP2)
USB3-0-RX_N: CN2.28
USB3-0-RX_P: CN2.30
USB3-0-TX_N: CN2.40
USB3-0-TX_P: CN2.42
USB3-1-D_N: CN2.65 USBC2.A7(DN1) USBC2.B7(DN2)
USB3-1-D_P: CN2.63 USBC2.A6(DP1) USBC2.B6(DP2)
USB3-1-RX_N: CN2.57
USB3-1-RX_P: CN2.59
USB3-1-TX_N: CN2.69
USB3-1-TX_P: CN2.71
USB_OTG_ID: CN2.1
USB_V+: C37.2 R1.1 U8.1(VBUS) USB2.2(B9) USB2.5(A9)
VSYS: C17.1 C19.1 C20.1 L2.2 L3.1 U8.8(OTG) U8.15(SYS) U8.16(SYS) U9.5(EN) U9.6(MODE) U9.7(VIN)
WL_NDISABLE: CN1.89
XIN: C2.2 U16.20(XIN) X1.1(OSC1)
XOUT: R49.2 U16.21(XOUT)
$1N24628: R43.1 USBC2.B5(CC2)
$1N24629: R44.1 USBC2.A5(CC1)
$1N24652: R2.1 U1.5(ILIM)
$1N24726: FPC2.17 R3.2
$1N24782: LED1.2(K) R6.1
$1N24806: R17.2 R18.1 U8.11(TS)
$1N24809: C34.1 L2.1 U8.19(SW) U8.20(SW)
$1N24813: C34.2 U8.21(BTST)
$1N24814: C36.2 U8.23(PMID)
$1N24816: R16.1 U8.10(ILIM)
$1N24818: L3.2 U9.2(SW)
$1N24821: R29.1 R30.2 U9.4(FB)
$1N24873: R27.1 U8.3(D-)
$1N24874: R27.2 U8.2(D+)
$1N24939: LED2.2(K) R39.1
$1N24949: R45.1 USBC1.B5(CC2)
$1N24952: R46.1 USBC1.A5(CC1)
$1N27773: LED3.1(K) R54.2
$1N27781: C62.2 R49.1 X1.3(OSC2)
$1N27788: BOOT.1 R51.1
$1N27789: R50.2 R52.2 U16.26(RUN)
$1N27792: LED3.2(A) U16.37(GPIO25)
$1N27793: R47.2 U16.47(USB_DP)
$1N27794: C63.2 R50.1 RESET.2
$1N27816: R48.1 U16.46(USB_DM)
$1N28945: R55.2 U18.3(EN)
$1N70030: R31.1 U5.44(BOOT0)
$1N70045: LED4.2(A) U5.11(PA1)
$1N70046: LED4.1(K) R32.1
$1N70476: C92.1 U5.5(PD0-OSC_IN) X2.2(OSC2)
$1N70509: C93.1 U5.6(PD1-OSC_OUT) X2.1(OSC1)
